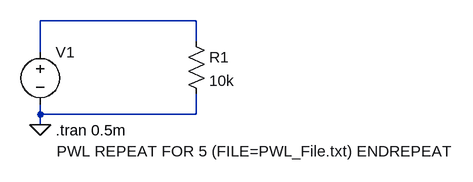
[diagram p0: schematic 05-PWL File Repeat.asc]
05-PWL File Repeat.asc, the LTspice schematic file:
Version 4
SHEET 1 1076 680
WIRE 320 64 80 64
WIRE 320 96 320 64
WIRE 80 112 80 64
WIRE 80 208 80 192
WIRE 320 208 320 176
WIRE 320 208 80 208
WIRE 80 224 80 208
FLAG 80 224 0
SYMBOL voltage 80 96 R0
WINDOW 3 25 169 Left 2
WINDOW 123 0 0 Left 2
WINDOW 39 0 0 Left 2
SYMATTR Value PWL REPEAT FOR 5 (FILE=PWL_File.txt) ENDREPEAT
SYMATTR InstName V1
SYMBOL res 304 80 R0
SYMATTR InstName R1
SYMATTR Value 10k
TEXT 104 232 Left 2 !.tran 0.5m

The netlist it stands for:
* 05-PWL File Repeat.asc
V1 N001 0 PWL REPEAT FOR 5 (FILE=PWL_File.txt) ENDREPEAT
R1 N001 0 10k
.tran 0.5m
.backanno
.end